# EAGLE board motherboard (EAGLE 9.4.2), part 1 of 2
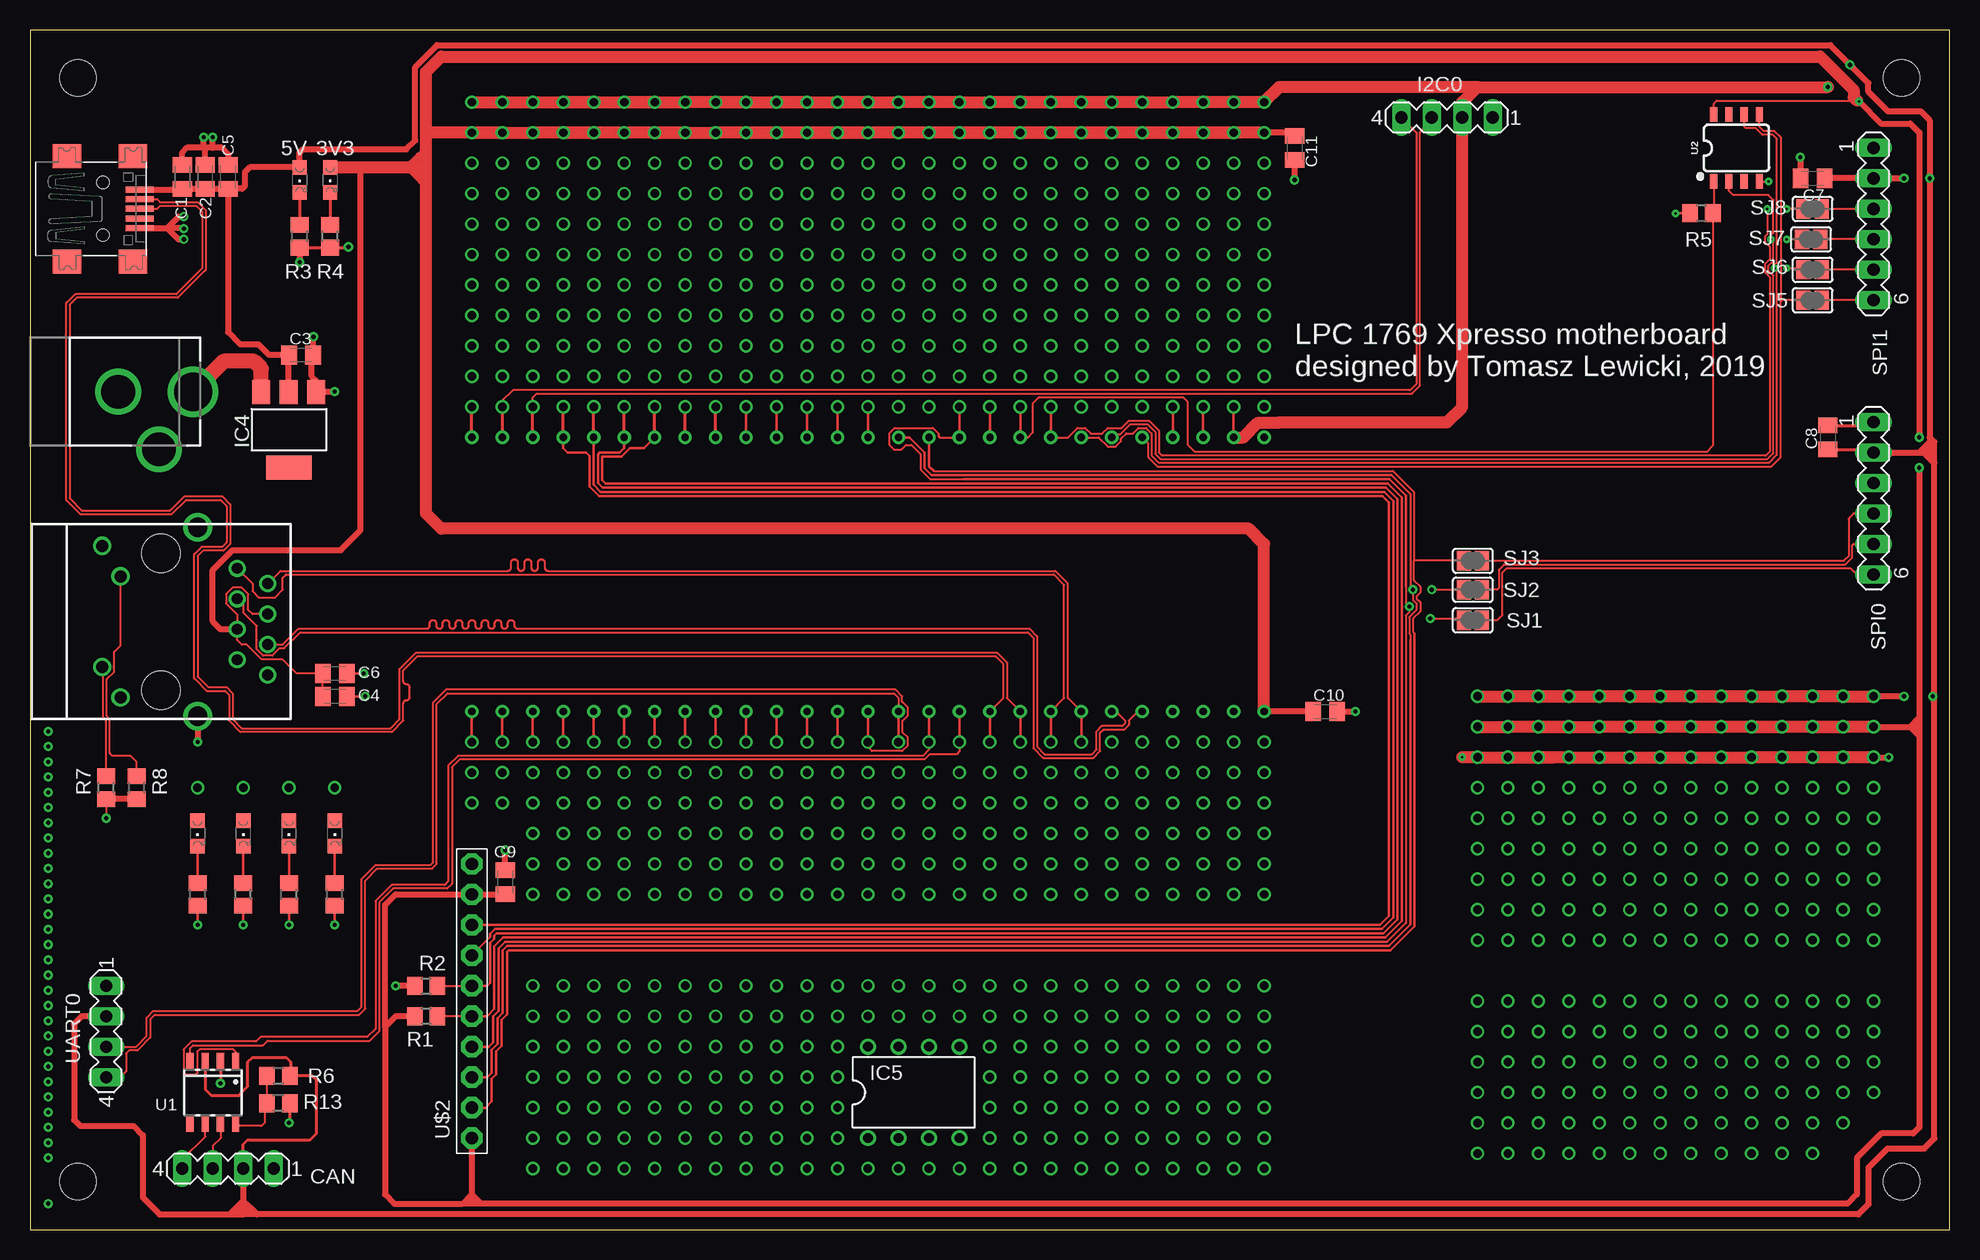
[diagram p1: board, top side]
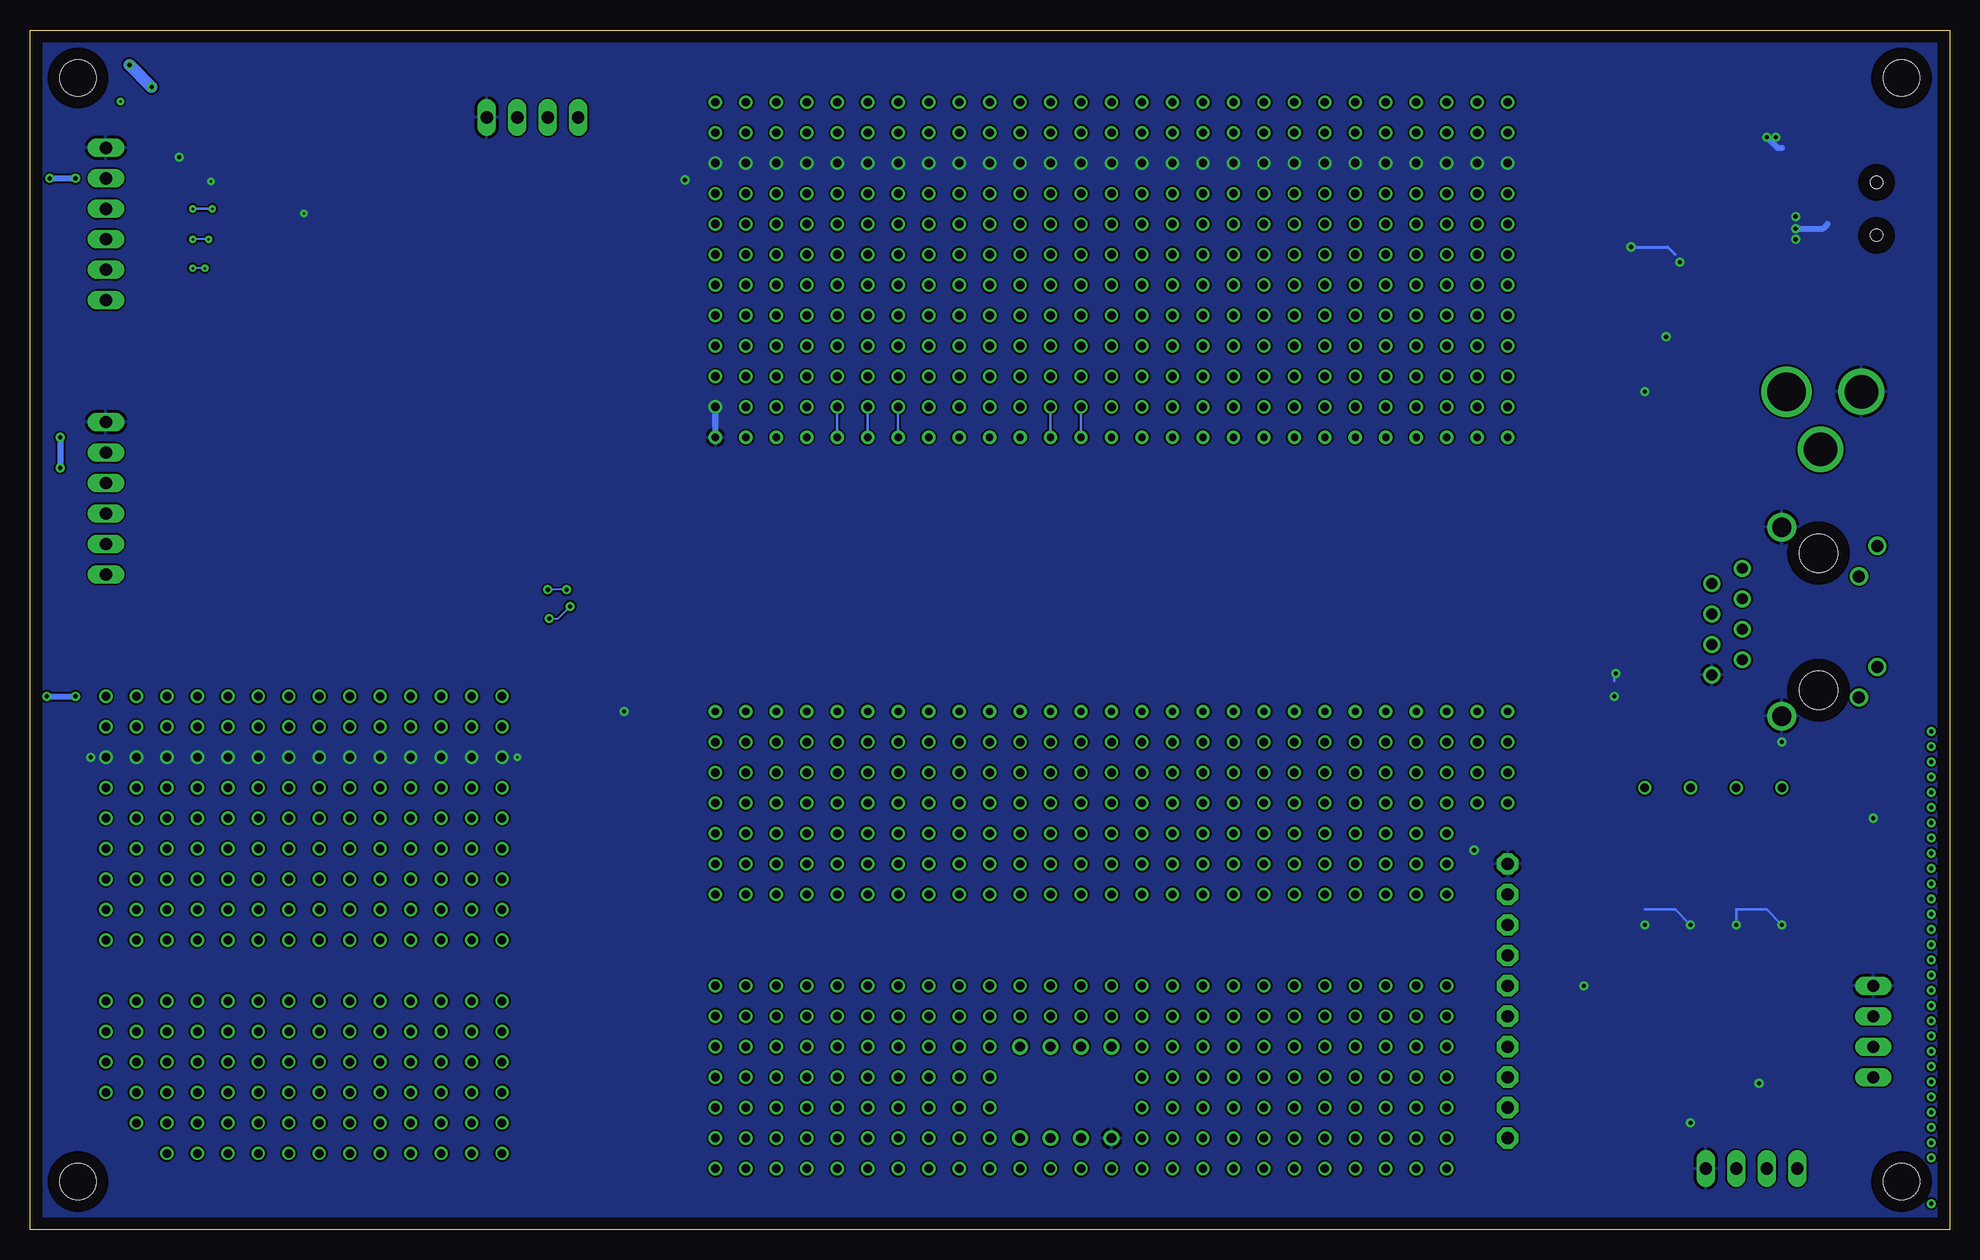
[diagram p2: board, bottom side, seen from below]

Size 160 x 100 mm. Coordinates in mm from the lower left corner, seen from the top.
Outline: 0,0 160,0 160,100 0,100 0,0
Copper layers (1*16): Top 0.035mm / dielectric 1.5mm / Bottom 0.035mm
Design rules "default *": minimum track width 6mil, minimum drill 0.2mm, track to track 6mil, track to pad 6mil, pad to pad 6mil, via to via 6mil, smd to smd 6mil, copper to edge 40mil, drill to drill 6mil, minimum pad ring 10mil, minimum via ring 8mil, stop-mask expansion 4mil, vias tented up to drill 0mil, thermal gap 10mil
Net classes: 1 power: width 0.406 mm
Holes 3 mm at 4,4 156,4 156,96 4,96

## Footprints (pad centres in the part's own frame; a part is rotated, then mirrored left to right if it is on the bottom)
CHIPLED_0805 = smd 1.2 x 1.2: A 0,-1.05; C 0,1.05
C0805K = smd 1.3 x 1.6: 1 -1,0; 2 1,0
MA04-1 = drill 1.016 long: 1 -3.81,0; 2 -1.27,0; 3 1.27,0; 4 3.81,0
USB-MINIB = smd 0.5 x 2.308: D+ 0,4.064; D- -0.8,4.064; GND 1.6,4.064; ID 0.8,4.064; VBUS -1.6,4.064 | smd 2 x 2.4: GND1 -4.4,-2; GND2 -4.4,3.5; GND3 4.4,3.5; GND4 4.4,-2 | hole 1: -2.2,1; 2.2,1
DCJACK_2MM_PTH = drill 2.8: GND 0,7.35; GNDBREAK 4.8,10.75 | drill 3.2: PWR 0,13.6
SOT223 = smd 1.499 x 2.007: 1 -2.261,-3.15; 2 0.025,-3.15; 3 2.311,-3.15 | smd 3.81 x 2.007: 4 0,3.15
DIL08 = drill 0.813 pad 1.27: 1 -3.81,-3.81; 2 -1.27,-3.81; 3 1.27,-3.81; 4 3.81,-3.81; 5 3.81,3.81; 6 1.27,3.81; 7 -1.27,3.81; 8 -3.81,3.81
J_ETHERNET_PULSE_J0011D01BNL = drill 0.9: 1 4.445,-6.35; 2 3.175,-8.89; 3 1.905,-6.35; 4 0.635,-8.89; 5 -0.635,-6.35; 6 -1.905,-8.89; 7 -3.175,-6.35; 8 -4.445,-8.89 | drill 1: 9 6.325,4.902; 10 3.785,3.378; 11 -3.785,4.902; 12 -6.325,3.378 | drill 1.6: SH1 -7.874,-3.048; SH2 7.874,-3.048 | hole 3.2: -5.715,0; 5.715,0
R0805 = smd 1.3 x 1.5: 1 -0.95,0; 2 0.95,0
SJ = smd 1.168 x 1.6: 1 -0.762,0; 2 0.762,0
MA06-1 = drill 1.016 long: 1 -6.35,0; 2 -3.81,0; 3 -1.27,0; 4 1.27,0; 5 3.81,0; 6 6.35,0
SOT96-1 = smd 0.6 x 1.3: 1 -1.905,-2.65; 2 -0.635,-2.65; 3 0.635,-2.65; 4 1.905,-2.65; 5 1.905,2.65; 6 0.635,2.65; 7 -0.635,2.65; 8 -1.905,2.65
SO08 = smd 0.6 x 1.2: 1 -1.905,-2.8; 2 -0.635,-2.8; 3 0.635,-2.8; 4 1.905,-2.8; 5 1.905,2.8; 6 0.635,2.8; 7 -0.635,2.8; 8 -1.905,2.8
LPC1769XPRESSO = drill 0.6: P$1 -33.02,-11.43; P$2 -30.48,-11.43; P$3 -27.94,-11.43; P$4 -25.4,-11.43; P$5 -22.86,-11.43; P$6 -20.32,-11.43; P$7 -17.78,-11.43; P$8 -15.24,-11.43; P$9 -12.7,-11.43; P$10 -10.16,-11.43; P$11 -7.62,-11.43; P$12 -5.08,-11.43; P$13 -2.54,-11.43; P$14 0,-11.43; P$15 2.54,-11.43; P$16 5.08,-11.43; P$17 7.62,-11.43; P$18 10.16,-11.43; P$19 12.7,-11.43; P$20 15.24,-11.43; P$21 17.78,-11.43; P$22 20.32,-11.43; P$23 22.86,-11.43; P$24 25.4,-11.43; P$25 27.94,-11.43; P$26 30.48,-11.43; P$27 33.02,-11.43; P$28 -33.02,11.43; P$29 -30.48,11.43; P$30 -27.94,11.43; P$31 -25.4,11.43; P$32 -22.86,11.43; P$33 -20.32,11.43; P$34 -17.78,11.43; P$35 -15.24,11.43; P$36 -12.7,11.43; P$37 -10.16,11.43; P$38 -7.62,11.43; P$39 -5.08,11.43; P$40 -2.54,11.43; P$41 0,11.43; P$42 2.54,11.43; P$43 5.08,11.43; P$44 7.62,11.43; P$45 10.16,11.43; P$46 12.7,11.43; P$47 15.24,11.43; P$48 17.78,11.43; P$49 20.32,11.43; P$50 22.86,11.43; P$51 25.4,11.43; P$52 27.94,11.43; P$53 30.48,11.43; P$54 33.02,11.43
1X10-BIG = drill 1.016 pad 1.778 octagon: 1 -11.43,0; 2 -8.89,0; 3 -6.35,0; 4 -3.81,0; 5 -1.27,0; 6 1.27,0; 7 3.81,0; 8 6.35,0; 9 8.89,0; 10 11.43,0

## Placement (x,y rotation side)
3V1  [CHIPLED_0805]  13.97,33.02 180 top
3V2  [CHIPLED_0805]  17.78,33.02 180 top
3V3  [CHIPLED_0805]  25.02,87.5 180 top
3V4  [CHIPLED_0805]  21.59,33.02 180 top
3V5  [CHIPLED_0805]  25.4,33.02 180 top
5V  [CHIPLED_0805]  22.48,87.5 180 top
C1  [C0805K]  12.7,87.76 90 top
C2  [C0805K]  14.61,87.76 90 top
C3  [C0805K]  22.61,72.9 0 top
C4  100n  [C0805K]  25.4,44.45 0 top
C5  [C0805K]  16.51,87.76 90 top
C6  100n  [C0805K]  25.4,46.35 0 top
C7  [C0805K]  148.59,87.63 180 top
C8  [C0805K]  149.86,66.04 90 top
C9  [C0805K]  39.62,28.96 90 top
C10  [C0805K]  107.95,43.18 0 top
C11  [C0805K]  105.41,90.17 270 top
CAN  [MA04-1]  16.51,5.08 180 top
CN1  [USB-MINIB]  5.08,85.09 270 top
CN2  [DCJACK_2MM_PTH]  0,69.85 270 top
I2C0  [MA04-1]  118.11,92.71 180 top
IC4  REG1117  [SOT223]  21.59,66.67 180 top
IC5  NE555N  [DIL08]  73.66,11.43 0 top
J1  J_ETHERNET_PULSE_J0011D01BNL  [J_ETHERNET_PULSE_J0011D01BNL]  10.92,50.67 90 top
R1  1k  [R0805]  33.02,17.78 180 top
R2  1k  [R0805]  33.02,20.32 0 top
R3  [R0805]  22.48,82.8 90 top
R4  [R0805]  25.02,82.8 90 top
R5  1k  [R0805]  139.32,84.71 180 top
R6  1k  [R0805]  20.7,12.83 0 top
R7  1k  [R0805]  6.35,36.83 90 top
R8  1k  [R0805]  8.89,36.83 90 top
R9  [R0805]  13.97,27.94 90 top
R10  [R0805]  17.78,27.94 90 top
R11  [R0805]  21.59,27.94 90 top
R12  [R0805]  25.4,27.94 90 top
R13  1k  [R0805]  20.7,10.54 180 top
SJ1  [SJ]  120.27,50.8 0 top
SJ2  [SJ]  120.27,53.34 0 top
SJ3  [SJ]  120.27,55.75 0 top
SJ5  [SJ]  148.59,77.47 0 top
SJ6  [SJ]  148.59,80.01 0 top
SJ7  [SJ]  148.46,82.55 0 top
SJ8  [SJ]  148.59,85.09 0 top
SPI0  [MA06-1]  153.67,60.96 270 top
SPI1  [MA06-1]  153.67,83.82 270 top
U1  TJA1050  [SOT96-1]  15.24,11.43 180 top
U2  4MB Flash  [SO08]  142.24,90.17 0 top
U$1  LPC1769XPRESSO  [LPC1769XPRESSO]  69.85,54.61 180 top
U$2  PINHD-1X10  [1X10-BIG]  36.83,19.05 90 top
UART0  [MA04-1]  6.35,16.51 270 top

## Tracks (layer width: path | path; a pad name or v marks a point on that pad's centre or on a via)
3V3  (via drill 0.2, 0.35, 0.7)
  Top 0.152: J1.4 18.54,51.31 18.2,51.65 18.2,52.96 17.66,53.51 16.89,53.51 16.34,52.96 16.34,52.19 17.27,51.26 J1.5 17.27,49.15 17.65,48.77 18.06,48.77 19.3,47.53 21.05,47.53 22.23,46.35 C6.1 C4.1 | U2.8 140.34,93.85 140.59,94.11 152.27,94.11 152.4,94.11 v152.46,94.04
  Top 0.508: v152.46,94.04 154.31,92.2 156.72,92.2 157.48,91.44 v157.48,66.04 | v157.48,63.5 157.48,42.67 | 157.48,42.67 157.48,42.55 | 157.48,42.55 157.48,41.91 | 157.48,41.91 157.48,41.15 | 157.48,41.15 157.48,8.51 156.97,8 154.31,8 152.27,5.97 152.27,2.92 151.51,2.16 37.59,2.16 | 37.59,2.16 36.83,2.16 | 36.83,2.16 36.07,2.16 | 36.07,2.16 30.35,2.16 29.59,2.92 29.59,16.89 | R1.2 30.48,17.78 29.59,16.89 | U$2.1 36.83,2.92 | 36.83,2.92 36.83,2.16 | 36.07,2.16 36.83,2.92 | 36.83,2.92 37.59,2.16 | 29.59,16.89 29.59,27.05 30.48,27.94 U$2.9 39.61,27.94 C9.1 | J1.5 15.88,50.04 15.24,50.67 15.24,54.99 16.89,56.64 25.91,56.64 27.56,58.29 27.56,88.17 27.94,88.55 | 32.38,89.53 31.75,88.9 31.75,88.55 32.1,88.9 33.02,88.9 32.38,89.53 | 32.38,89.53 33.02,90.17 | v153.67,41.91 156.72,41.91 | 156.72,41.91 156.84,41.91 | 157.48,41.91 156.84,41.91 | 157.48,42.55 156.84,41.91 | 156.84,41.91 156.84,41.78 157.48,41.15 | 157.48,42.67 156.72,41.91 | C11.1 105.14,91.44 v102.87,91.44 | C10.1 U$1.P$28
  Top 1.016: U$1.P$28 102.87,57.15 101.6,58.42 34.29,58.42 33.02,59.69 33.02,87.5 | 33.02,87.5 33.02,88.9 | 33.02,88.9 33.02,90.17 33.02,91.44 | 33.02,91.44 33.02,96.52 34.29,97.79 149.22,97.79 152.02,95 152.02,94.36 152.27,94.11 | 3V3.A 27.94,88.55 31.75,88.55 | 31.75,88.55 32.67,88.55 33.02,88.9 | 31.75,88.55 32.8,87.5 33.02,87.5 | v102.87,91.44 v100.33,91.44 | v100.33,91.44 v95.25,91.44 | v95.25,91.44 v90.17,91.44 | v90.17,91.44 v85.09,91.44 | v85.09,91.44 v80.01,91.44 | v80.01,91.44 v74.93,91.44 | v74.93,91.44 v69.85,91.44 v67.31,91.44 | v62.23,91.44 v57.15,91.44 v54.61,91.44 | v54.61,91.44 v46.99,91.44 | v46.99,91.44 v41.91,91.44 v39.37,91.44 | v39.37,91.44 33.02,91.44 | v36.83,91.44 v39.37,91.44 | v44.45,91.44 v46.99,91.44 | v49.53,91.44 v46.99,91.44 | v52.07,91.44 v54.61,91.44 | v59.69,91.44 v62.23,91.44 | v74.93,91.44 v77.47,91.44 v80.01,91.44 | v72.39,91.44 v67.31,91.44 | v67.31,91.44 v62.23,91.44 | v64.77,91.44 v67.31,91.44 | v82.55,91.44 v85.09,91.44 | v87.63,91.44 v90.17,91.44 | v92.71,91.44 v95.25,91.44 | v97.79,91.44 v100.33,91.44 | v151.13,41.91 v146.05,41.91 | v146.05,41.91 v140.97,41.91 | v140.97,41.91 v135.89,41.91 | v135.89,41.91 v130.81,41.91 v128.27,41.91 | v133.35,41.91 v135.89,41.91 | v138.43,41.91 v140.97,41.91 | v143.51,41.91 v146.05,41.91 | v148.59,41.91 v151.13,41.91 | v153.67,41.91 v151.13,41.91 | v128.27,41.91 v123.19,41.91 v120.65,41.91 | v125.73,41.91 v128.27,41.91
  Bottom 0.508: v157.48,66.04 v157.48,63.5
5V0  (via drill 0.35, 0.7)
  Top 0.2: v100.33,68.58 U$1.P$2
  Top 0.254: 12.06,86.69 12.63,86.69 C1.1 | U1.3 14.61,11.68 15.11,11.18 17.4,11.18 18.16,11.94 18.16,13.97 18.54,14.35 21.34,14.35 21.72,13.97 21.72,12.89 R6.2 23.5,12.83 23.88,12.45 23.88,8 23.37,7.49 18.16,7.49 17.78,7.11 CAN.2 | C8.1 153.4,65.04 SPI0.2
  Top 0.508: C5.1 17.67,86.76 17.91,87 17.91,88.14 18.32,88.55 5V.A 22.48,89.79 22.73,90.04 31.37,90.04 32.11,90.78 32.11,96.9 33.94,98.73 150.06,98.73 v151.7,97.09 153.23,95.56 153.23,94.85 154.87,93.22 157.61,93.22 158.35,92.48 v158.35,87.63 158.35,66.04 | CN1.VBUS 12.06,86.69 | C1.1 C2.1 C5.1 | IC4.2 21.57,72.86 C3.1 19.94,72.9 19.05,73.79 17.53,73.79 16.51,74.8 C5.1 | 158.73,44.45 158.73,7.6 157.9,6.77 154.85,6.77 153.23,5.15 153.23,2.1 152.4,1.27 18.92,1.27 | 158.73,44.45 158.73,63.9 | SPI0.2 157.48,64.77 | 157.48,64.77 157.86,64.77 | v156.21,87.63 SPI1.2 C7.1 | 158.73,63.9 158.31,64.33 | 158.31,64.33 157.86,64.77 | 158.31,64.33 158.35,64.37 158.35,64.77 | 158.35,66.04 158.35,65.53 | 158.35,65.53 158.35,64.77 | 157.48,64.77 158.24,65.53 158.35,65.53 | 158.35,64.77 157.86,64.77 | 158.73,63.9 158.73,65.66 158.35,66.04 | 158.73,44.45 v158.61,44.45 | v156.21,44.45 v153.67,44.45 | 18.92,1.27 18.35,1.84 | 18.35,1.84 17.78,2.41 | UART0.2 4.32,17.78 3.68,17.14 3.68,9.14 4.19,8.64 8.64,8.64 9.4,7.87 9.4,2.67 10.79,1.27 16.64,1.27 | 16.64,1.27 17.78,1.27 | 18.92,1.27 17.78,1.27 | 17.46,2.1 17.21,1.84 | 17.21,1.84 16.64,1.27 | 17.78,1.27 17.78,1.78 17.46,2.1 | 17.78,1.27 17.21,1.84 | 17.78,1.27 18.35,1.84 | CAN.2 17.78,2.41 | 17.78,2.41 17.46,2.1
  Top 1.016: U$1.P$2 101.15,66.04 102.37,67.25 104.08,67.25 104.14,67.31 118.11,67.31 119.38,68.58 I2C0.2 119.38,93.98 120.65,95.25 | 120.65,95.25 v149.86,95.25 | 120.65,95.25 104.14,95.25 v102.87,93.98 v100.33,93.98 v97.79,93.98 v95.25,93.98 v92.71,93.98 v90.17,93.98 | v36.83,93.98 v41.91,93.98 | v39.37,93.98 v41.91,93.98 | v90.17,93.98 v85.09,93.98 | v85.09,93.98 v80.01,93.98 v77.47,93.98 v74.93,93.98 v72.39,93.98 v67.31,93.98 | v82.55,93.98 v85.09,93.98 | v87.63,93.98 v90.17,93.98 | v41.91,93.98 v44.45,93.98 | v44.45,93.98 v49.53,93.98 | v49.53,93.98 v54.61,93.98 v57.15,93.98 | v57.15,93.98 v62.23,93.98 | v62.23,93.98 v67.31,93.98 | v69.85,93.98 v67.31,93.98 | v64.77,93.98 v62.23,93.98 | v59.69,93.98 v57.15,93.98 | v52.07,93.98 v49.53,93.98 | v46.99,93.98 v44.45,93.98 | v128.27,44.45 v123.19,44.45 v120.65,44.45 | v125.73,44.45 v128.27,44.45 | v140.97,44.45 v143.51,44.45 v146.05,44.45 v148.59,44.45 v151.13,44.45 v153.67,44.45 | v140.97,44.45 v135.89,44.45 | v135.89,44.45 v130.81,44.45 v128.27,44.45 | v133.35,44.45 v135.89,44.45 | v138.43,44.45 v140.97,44.45
  Bottom 0.508: v158.35,87.63 v156.21,87.63 | v158.61,44.45 v156.21,44.45
  Bottom 1.016: v149.86,95.25 v151.7,97.09
12V0
  Top 1.27: CN2.PWR 16.14,72.39 18.67,72.39 19.3,71.75 19.28,71.73 IC4.3
CAN_H
  Top 0.152: U1.7 15.88,7.62 15.24,6.99 CAN.3
CAN_L
  Top 0.152: CAN.4 12.7,5.84 14.61,7.75 U1.6
CAN_RX  (via drill 0.7)
  Top 0.152: v77.47,40.64 77.47,39.88 77.22,39.62 74.98,39.62 74.55,39.19 35.81,39.19 35.18,38.56 35.18,28.83 34.77,28.42 30.28,28.42 29.11,27.25 29.11,16.54 28.32,15.75 19.81,15.75 19.43,15.37 13.59,15.37 13.34,15.11 U1.4
  Top 0.2: U$1.P$38 v77.47,40.64
CAN_TX  (via drill 0.7)
  Top 0.152: v74.93,40.64 74.93,40.01 74.42,39.5 35.69,39.5 34.87,38.68 34.87,29.06 34.54,28.73 30.15,28.73 28.8,27.38 28.8,16.74 28.12,16.05 19.23,16.05 18.85,15.67 13.46,15.67 12.81,15.02 12.81,13.1 12.95,12.95 13.84,12.95 13.97,13.08 13.97,14.86 14.17,15.06 16.89,15.06 17.14,14.81 U1.1
  Top 0.2: U$1.P$39 v74.93,40.64
CARD_CS  (via drill 0.7)
  Top 0.152: R2.2 U$2.6
  Top 0.2: U$1.P$22 49.53,65.15 49.15,64.77 47.5,64.77 47.34,64.61 47.34,62.23 47.72,61.85 113.03,61.85 113.99,60.89 113.99,25.87 112.81,24.7 38.91,24.7 38.71,24.49 38.71,24.24 38.35,23.89 38.35,20.57 38.1,20.32 U$2.6
  Top 0.254: U$1.P$22 v49.53,68.58
CS1  (via drill 0.2, 0.7)
  Top 0.152: U$1.P$8 86.52,66.04 87.31,66.82 87.95,66.82 88.43,66.34 89.37,66.34 89.85,66.82 90.98,66.82 91.59,67.43 93.29,67.43 94.1,66.62 94.1,64.78 94.36,64.52 144.68,64.52 145.01,64.84 145.01,79.4 144.6,79.8 144.6,80.47 145.01,80.88 145.01,81.94 144.6,82.34 144.6,82.76 144.81,82.96 v144.81,85.09
  Top 0.2: SJ8.1 v146.43,85.09 | U$1.P$8 v85.09,68.58
  Bottom 0.2: v146.43,85.09 v144.81,85.09
ETH_RX_N
  Top 0.152: U$1.P$33 90.53,43.18 91.29,42.42 91.29,42.19 91.06,41.96 89.33,41.96 88.9,41.53 88.9,40.01 88.52,39.62 84.58,39.62 83.95,40.26 83.95,49.45 83.31,50.09 40.64,50.09 arc-90 40.37,50.35 40.37,50.54 arc90 40.11,50.8 40.1,50.8 arc90 39.83,50.54 39.83,50.35 arc-90 39.56,50.09 39.55,50.09 arc-90 39.29,50.35 39.29,50.54 arc90 39.02,50.8 39.01,50.8 arc90 38.74,50.54 38.74,50.35 arc-90 38.48,50.09 38.47,50.09 arc-90 38.2,50.35 38.2,50.54 arc90 37.94,50.8 37.93,50.8 arc90 37.66,50.54 37.66,50.35 arc-90 37.39,50.09 37.38,50.09 arc-90 37.12,50.35 37.12,50.54 arc90 36.85,50.8 36.84,50.8 arc90 36.57,50.54 36.57,50.35 arc-90 36.31,50.09 36.3,50.09 arc-90 36.03,50.35 36.03,50.54 arc90 35.76,50.8 35.75,50.8 arc90 35.49,50.54 35.49,50.35 arc-90 35.22,50.09 35.21,50.09 arc-90 34.95,50.35 34.95,50.54 arc90 34.68,50.8 34.67,50.8 arc90 34.4,50.54 34.4,50.35 arc-90 34.13,50.09 34.13,50.09 arc-90 33.86,50.35 33.86,50.54 arc90 33.59,50.8 33.58,50.8 arc90 33.32,50.54 33.32,50.35 arc-90 33.05,50.09 22.4,50.09 21.08,48.77 J1.6
ETH_RX_P
  Top 0.152: U$1.P$32 92.35,43.18 91.59,42.42 91.59,42.06 91.19,41.66 89.46,41.66 89.2,41.4 89.2,39.88 88.64,39.32 84.46,39.32 83.64,40.13 83.64,49.33 83.19,49.78 22.53,49.78 21.21,48.46 20.83,48.46 20.2,47.84 19.43,47.84 18.88,48.38 18.88,49.15 18.9,49.17 18.9,50.32 17.78,51.44 17.78,52.07 J1.3
ETH_TX_N  (via drill 0.7)
  Top 0.152: U$1.P$34 86.51,44.3 86.51,53.87 85.47,54.91 43.18,54.91 arc-90 42.91,55.18 42.91,55.6 arc90 42.65,55.87 42.62,55.87 arc90 42.35,55.6 42.35,55.18 arc-90 42.08,54.91 42.05,54.91 arc-90 41.79,55.18 41.79,55.6 arc90 41.52,55.87 41.49,55.87 arc90 41.23,55.6 41.23,55.18 arc-90 40.96,54.91 40.93,54.91 arc-90 40.66,55.18 40.66,55.6 arc90 40.4,55.87 40.37,55.87 arc90 40.1,55.6 40.1,55.18 arc-90 39.84,54.91 20.88,54.91 J1.2
  Top 0.2: v87.63,40.64 U$1.P$34
ETH_TX_P  (via drill 0.7)
  Top 0.152: U$1.P$35 86.21,44.3 86.21,53.75 85.34,54.61 21.34,54.61 21.08,54.36 21.08,53.34 20.45,52.7 19.05,52.7 18.54,53.21 18.54,53.85 J1.1
  Top 0.2: U$1.P$35 v85.09,40.64
GND  (via drill 0.2, 0.35, 0.7)
  Top 0.152: R7.1 v6.35,34.29 | U2.4 v144.9,87.37 v144.91,87.38
  Top 0.2: R9.1 v13.97,25.4 | R10.1 v17.78,25.4 | R11.1 v21.59,25.4 | R12.1 v25.4,25.4 | C6.2 v27.81,46.35 | C4.2 v27.94,44.45 | R5.2 v137.16,84.71
  Top 0.254: v26.54,81.92 26.48,81.85 R4.1 R3.1 | U1.2 v15.88,12.19 | R13.1 21.65,8.95 v21.59,8.89 | C8.2 153.4,67.04 SPI0.1
  Top 0.508: 11.43,83.49 12.78,83.49 v12.83,83.44 | CN1.GND 11.43,83.49 | 11.43,83.49 12.37,82.55 v12.83,82.55 | 11.43,83.49 12.39,84.45 v12.83,84.45 | C1.2 12.7,89.79 13.08,90.17 14.48,90.17 | 15.24,90.17 16,90.17 16.51,89.66 C5.2 | 15.24,90.17 14.48,90.17 | C2.2 14.61,90.04 14.48,90.17 | 14.48,90.17 v14.48,91.06 | 15.24,90.17 v15.24,91.06 | J1.SH1 v13.97,40.64 | R8.1 R7.1 | R3.1 v22.48,80.64 | v23.62,74.42 23.61,74.41 C3.2 23.5,72.79 23.5,71.12 23.85,70.76 IC4.1 23.88,69.85 v25.4,69.85 | R2.1 v30.48,20.32 | v153.67,39.37 v154.94,39.37 | C7.2 147.59,89.39 v147.57,89.41 | C9.2 v39.62,31.62 | C11.2 v105.41,87.5 | C10.2 v110.49,43.18
  Top 1.016: v153.67,39.37 v151.13,39.37 v148.59,39.37 v143.51,39.37 v140.97,39.37 v138.43,39.37 v135.89,39.37 v133.35,39.37 v130.81,39.37 v128.27,39.37 v125.73,39.37 | v119.38,39.37 v120.65,39.37 v123.19,39.37 v125.73,39.37 | v125.73,39.37 127.08,39.37
  Bottom 0.2: v13.97,25.4 15.24,26.67 17.78,26.67 v17.78,25.4 | v21.59,25.4 22.86,26.67 25.4,26.67 | v27.81,46.35 27.94,46.23 27.94,45.72
  Bottom 0.254: v26.54,81.92 23.5,81.92 22.86,81.28
  Bottom 0.508: v12.83,83.44 10.54,83.44 10.16,83.82 | v15.24,91.06 14.35,90.17 13.97,90.17 | U$1.P$1 v102.87,68.58
  other vias: 36.83,88.9 39.37,88.9 41.91,88.9 44.45,88.9 46.99,88.9 49.53,88.9 52.07,88.9 54.61,88.9 57.15,88.9 59.69,88.9 62.23,88.9 64.77,88.9 67.31,88.9 69.85,88.9 72.39,88.9 74.93,88.9 77.47,88.9 80.01,88.9 85.09,88.9 82.55,88.9 87.63,88.9 90.17,88.9 92.71,88.9 95.25,88.9 97.79,88.9 100.33,88.9 102.87,88.9 146.05,39.37
  pour Bottom: 0,100.33 160.02,100.33 160.02,0 0,0
I2C_SDA  (via drill 0.7)
  Top 0.152: I2C0.3 116.84,92.46 115.88,91.49 115.88,70.36 115.19,69.67 42.24,69.67 41.91,69.34 v41.91,68.58
  Top 0.254: U$1.P$25 v41.91,68.58
LCD_CS  (via drill 0.7)
  Top 0.152: U$2.5 R1.1
  Top 0.2: U$2.5 38.1,17.78 38.71,18.39 38.71,23.59 39.46,24.34 112.96,24.34 114.34,25.72 114.34,61.04 113.18,62.2 47.98,62.2 47.7,62.48 47.7,64.42 49.3,64.42 50.03,65.15 51.18,65.15 U$1.P$21
  Top 0.254: U$1.P$21 v52.07,68.58
LCD_O/C  (via drill 0.7)
  Top 0.2: U$1.P$23 46.99,62.08 47.58,61.5 112.88,61.5 113.64,60.74 113.64,26.02 112.67,25.05 111.76,25.05 38.76,25.05 38.35,24.64 38.35,24.38 U$2.7
  Top 0.254: U$1.P$23 v46.99,68.58
LCD_RST  (via drill 0.7)
  Top 0.152: 44.58,65.91 U$1.P$24
  Top 0.2: U$1.P$24 44.45,65.15 44.83,64.77 46.35,64.77 46.64,64.49 46.64,61.94 47.43,61.14 112.74,61.14 112.98,60.91 113.25,60.64 113.28,60.6 113.28,45.72 113.28,26.16 112.52,25.4 U$2.8
  Top 0.254: U$1.P$24 v44.45,68.58
MISO0  (via drill 0.7)
  Top 0.152: 115.37,55.75 115.37,61.18 115.38,61.19 115.38,61.46 113.6,63.23 75.32,63.23 74.99,63.56 | SJ3.1 115.37,55.75 | 115.37,55.75 115.37,54.11 115.88,53.59 115.88,53.09 115.58,52.79 115.58,52.62 115.88,52.32 115.88,51.52 115.28,50.92 115.28,49.82 115.39,49.7 | 115.39,25.29 115.4,25.29
  Top 0.2: U$2.2 37.97,10.16 38.48,10.67 38.48,12.58 38.83,12.94 38.83,14.85 39.31,15.33 39.31,17.48 39.76,17.93 39.76,23.13 39.92,23.29 113.4,23.29 115.4,25.29 115.41,25.3 115.41,49.68 115.39,49.7 | 75.3,63.26 74.99,63.56 74.93,63.63 U$1.P$12
  Bottom 0.2: U$1.P$12 v74.93,68.58
MISO1  (via drill 0.2, 0.7)
  Top 0.152: U$1.P$6 90.42,66.29 90.88,66.29 91.72,67.13 93.16,67.13 93.8,66.49 93.8,64.65 94.23,64.21 144.81,64.21 145.31,64.72 145.31,79.52 144.91,79.93 144.91,80.35 145.31,80.75 145.31,82.35 v145.11,82.55 145.11,82.88 145.31,83.08 145.31,85.83 144.91,86.23 141.99,86.23 141.6,86.61 U2.2 | v146.43,82.55 SJ7.1
  Bottom 0.152: v145.11,82.55 v146.43,82.55
  Bottom 0.2: U$1.P$6 v90.17,68.58
MOSI0  (via drill 0.35, 0.7)
  Top 0.152: 77.98,62.55 75.04,62.55 74.25,63.34 74.25,64.63 73.48,65.41 73.03,65.41 72.64,65.02 72.01,65.02 71.61,65.43 71.61,66.36 72.07,66.82 75.25,66.82 75.71,66.36 75.71,66.15 75.82,66.04 U$1.P$11 | 114.69,53.65 114.69,53.62 114.67,53.59 114.67,52.24 v114.97,51.94 114.97,51.47 114.67,51.17 114.67,25.55 | v116.71,50.93 119.38,50.93 SJ1.1
  Top 0.2: U$2.4 38.23,15.24 38.61,15.62 38.61,17.79 39.06,18.24 39.06,23.43 39.62,23.99 113.11,23.99 114.67,25.55 | 77.85,62.55 77.98,62.55 113.32,62.55 114.69,61.18 114.69,53.65 | U$1.P$11 v77.47,68.58
  Bottom 0.152: v116.71,50.93 115.99,50.93 v114.97,51.94
MOSI1  (via drill 0.7)
  Top 0.152: U$1.P$5 93.19,65.56 93.19,64.4 93.98,63.6 145.14,63.6 145.92,64.39 145.92,77.34 | U2.5 144.15,91.95 144.53,91.57 145.41,91.57 145.92,91.06 145.92,77.6 | 145.92,77.34 145.92,77.47 | 145.92,77.6 145.92,77.47 | SJ5.1 146.05,77.47 | 145.92,77.47 146.05,77.47 | 146.05,77.47 145.92,77.34 | 146.05,77.47 145.92,77.6
  Bottom 0.2: v92.71,68.58 U$1.P$5
N$1
  Top 0.254: 5V.C R3.2
N$2  (via drill 0.7)
  other vias: 13.97,36.83
N$3
  Top 0.254: 3V3.C R4.2
N$4  (via drill 0.7)
  Top 0.152: I2C0.4 115.57,91.44 115.57,70.48 115.06,69.98 40.26,69.98 39.37,69.09 v39.37,68.58
  Top 0.254: v39.37,68.58 U$1.P$26
N$5  (via drill 0.7)
  other vias: 17.78,36.83
N$6  (via drill 0.7)
  other vias: 21.59,36.83
N$7  (via drill 0.7)
  other vias: 25.4,36.83
N$8  (via drill 0.7)
  Top 0.2: U$1.P$14 v69.85,68.58
N$9
  Top 0.152: SJ1.2 122.3,50.8 122.73,51.23 122.73,54.79 123.09,55.14 151.74,55.14 152.27,54.61 SPI0.6
N$10
  Top 0.152: SPI0.5 152.02,57.15 151.89,57.02 151.89,56.01 151.33,55.45 122.89,55.45 122.43,54.99 122.43,53.47 122.3,53.34 SJ2.2
N$11
  Top 0.152: SJ3.2 151.21,55.75 151.59,56.13 151.59,59.26 152.02,59.69 SPI0.4
N$12  (via drill 0.7)
  other vias: 57.15,15.24
N$13  (via drill 0.7)
  other vias: 59.69,15.24
N$14  (via drill 0.7)
  other vias: 62.23,15.24
N$15  (via drill 0.7)
  other vias: 67.31,12.7
N$16  (via drill 0.7)
  other vias: 57.15,12.7
N$17  (via drill 0.7)
  other vias: 59.69,12.7
N$18  (via drill 0.7)
  other vias: 62.23,12.7
N$19  (via drill 0.7)
  other vias: 64.77,12.7
N$20  (via drill 0.7)
  other vias: 57.15,10.16
N$21  (via drill 0.7)
  other vias: 59.69,10.16
N$22  (via drill 0.7)
  other vias: 62.23,10.16
N$23  (via drill 0.7)
  other vias: 64.77,10.16
N$24  (via drill 0.7)
  other vias: 57.15,7.62
N$25  (via drill 0.7)
  other vias: 59.69,7.62
N$26  (via drill 0.7)
  other vias: 62.23,7.62
N$27  (via drill 0.7)
  other vias: 64.77,7.62
N$28  (via drill 0.7)
  other vias: 67.31,10.16
N$29  (via drill 0.7)
  other vias: 67.31,7.62
N$30
  Top 0.152: U1.8 17.29,8.64 19.3,8.64 19.56,8.89 19.56,10.35 R13.2 R6.1
N$31  (via drill 0.35)
  other vias: 1.52,9.78
N$32  (via drill 0.35)
  other vias: 1.52,8.51
N$33  (via drill 0.35)
  other vias: 1.52,7.24
N$34  (via drill 0.35)
  other vias: 1.52,5.97
N$37  (via drill 0.35)
  other vias: 1.52,2.16
N$51  (via drill 0.7)
  other vias: 90.17,40.64
N$52  (via drill 0.7)
  other vias: 92.71,40.64
N$53  (via drill 0.7)
  other vias: 95.25,40.64
N$54  (via drill 0.7)
  other vias: 97.79,40.64
N$55  (via drill 0.7)
  other vias: 100.33,40.64
N$56  (via drill 0.7)
  other vias: 102.87,40.64
N$60
  Top 0.152: J1.11 6.1,46.81 6.1,42.67 6.35,42.42 R7.2
N$61
  Top 0.152: R8.2 8.89,38.99 8.38,39.5 6.86,39.5 6.66,39.7 6.66,42.54 6.4,42.8 6.4,45.88 7,46.48 7,48.15 7.54,48.69 J1.10
N$63  (via drill 0.7)
  other vias: 128.27,24.13
N$67
  Top 0.2: 3V1.C R9.2
N$68
  Top 0.2: 3V2.C R10.2
N$69
  Top 0.2: 3V4.C R11.2
N$70
  Top 0.2: R12.2 3V5.C
N$71  (via drill 0.7)
  other vias: 36.83,71.12
N$72  (via drill 0.7)
  other vias: 39.37,71.12
N$73  (via drill 0.7)
  other vias: 41.91,71.12
N$74  (via drill 0.7)
  other vias: 44.45,71.12
N$75  (via drill 0.7)
  other vias: 46.99,71.12
N$76  (via drill 0.7)
  other vias: 49.53,71.12
N$77  (via drill 0.7)
  other vias: 52.07,71.12
N$78  (via drill 0.7)
  other vias: 54.61,71.12
N$79  (via drill 0.7)
  other vias: 57.15,71.12
N$80  (via drill 0.7)
  other vias: 59.69,71.12
N$81  (via drill 0.7)
  other vias: 62.23,71.12
N$82  (via drill 0.7)
  other vias: 64.77,71.12
N$83  (via drill 0.7)
  other vias: 67.31,71.12
N$84  (via drill 0.7)
  other vias: 69.85,71.12
N$85  (via drill 0.7)
  other vias: 72.39,71.12
N$86  (via drill 0.7)
  other vias: 74.93,71.12
N$87  (via drill 0.7)
  other vias: 77.47,71.12
N$88  (via drill 0.7)
  other vias: 80.01,71.12
N$89  (via drill 0.7)
  other vias: 82.55,71.12
N$90  (via drill 0.7)
  other vias: 85.09,71.12
N$91  (via drill 0.7)
  other vias: 87.63,71.12
N$92  (via drill 0.7)
  other vias: 90.17,71.12
N$93  (via drill 0.7)
  other vias: 92.71,71.12
N$94  (via drill 0.7)
  other vias: 95.25,71.12
N$95  (via drill 0.7)
  other vias: 97.79,71.12
N$96  (via drill 0.7)
  other vias: 100.33,71.12
N$97  (via drill 0.7)
  other vias: 102.87,71.12
N$98  (via drill 0.7)
  other vias: 36.83,73.66
N$99  (via drill 0.7)
  other vias: 39.37,73.66
N$100  (via drill 0.7)
  other vias: 41.91,73.66
N$101  (via drill 0.7)
  other vias: 44.45,73.66
N$102  (via drill 0.7)
  other vias: 46.99,73.66
N$103  (via drill 0.7)
  other vias: 49.53,73.66
N$104  (via drill 0.7)
  other vias: 52.07,73.66
N$105  (via drill 0.7)
  other vias: 54.61,73.66
N$106  (via drill 0.7)
  other vias: 57.15,73.66
N$107  (via drill 0.7)
  other vias: 59.69,73.66
N$108  (via drill 0.7)
  other vias: 62.23,73.66
N$109  (via drill 0.7)
  other vias: 64.77,73.66
N$110  (via drill 0.7)
  other vias: 67.31,73.66
N$111  (via drill 0.7)
  other vias: 69.85,73.66
N$112  (via drill 0.7)
  other vias: 72.39,73.66
N$113  (via drill 0.7)
  other vias: 74.93,73.66
N$114  (via drill 0.7)
  other vias: 77.47,73.66
N$115  (via drill 0.7)
  other vias: 80.01,73.66
N$116  (via drill 0.7)
  other vias: 82.55,73.66
N$117  (via drill 0.7)
  other vias: 85.09,73.66
N$118  (via drill 0.7)
  other vias: 87.63,73.66
N$119  (via drill 0.7)
  other vias: 90.17,73.66
N$120  (via drill 0.7)
  other vias: 92.71,73.66
N$121  (via drill 0.7)
  other vias: 95.25,73.66
N$122  (via drill 0.7)
  other vias: 97.79,73.66
N$123  (via drill 0.7)
  other vias: 100.33,73.66
N$124  (via drill 0.7)
  other vias: 102.87,73.66
N$125  (via drill 0.7)
  other vias: 36.83,76.2
N$126  (via drill 0.7)
  other vias: 39.37,76.2
N$127  (via drill 0.7)
  other vias: 41.91,76.2
N$128  (via drill 0.7)
  other vias: 44.45,76.2
N$129  (via drill 0.7)
  other vias: 46.99,76.2
N$130  (via drill 0.7)
  other vias: 49.53,76.2
N$131  (via drill 0.7)
  other vias: 52.07,76.2
N$132  (via drill 0.7)
  other vias: 54.61,76.2
N$133  (via drill 0.7)
  other vias: 57.15,76.2
N$134  (via drill 0.7)
  other vias: 59.69,76.2
N$135  (via drill 0.7)
  other vias: 62.23,76.2
N$136  (via drill 0.7)
  other vias: 64.77,76.2
N$137  (via drill 0.7)
  other vias: 67.31,76.2
N$138  (via drill 0.7)
  other vias: 69.85,76.2
N$139  (via drill 0.7)
  other vias: 72.39,76.2
N$140  (via drill 0.7)
  other vias: 74.93,76.2
N$141  (via drill 0.7)
  other vias: 77.47,76.2
N$142  (via drill 0.7)
  other vias: 80.01,76.2
N$143  (via drill 0.7)
  other vias: 82.55,76.2
N$144  (via drill 0.7)
  other vias: 85.09,76.2
N$145  (via drill 0.7)
  other vias: 87.63,76.2
N$146  (via drill 0.7)
  other vias: 90.17,76.2
N$147  (via drill 0.7)
  other vias: 92.71,76.2
N$148  (via drill 0.7)
  other vias: 95.25,76.2
N$149  (via drill 0.7)
  other vias: 97.79,76.2
N$150  (via drill 0.7)
  other vias: 100.33,76.2
N$151  (via drill 0.7)
  other vias: 102.87,76.2
N$152  (via drill 0.7)
  other vias: 36.83,78.74
N$153  (via drill 0.7)
  other vias: 39.37,78.74
N$154  (via drill 0.7)
  other vias: 41.91,78.74
N$155  (via drill 0.7)
  other vias: 44.45,78.74
N$156  (via drill 0.7)
  other vias: 46.99,78.74
N$157  (via drill 0.7)
  other vias: 49.53,78.74
N$158  (via drill 0.7)
  other vias: 52.07,78.74
N$159  (via drill 0.7)
  other vias: 54.61,78.74
N$160  (via drill 0.7)
  other vias: 57.15,78.74
N$161  (via drill 0.7)
  other vias: 59.69,78.74
N$162  (via drill 0.7)
  other vias: 62.23,78.74
N$163  (via drill 0.7)
  other vias: 64.77,78.74
N$164  (via drill 0.7)
  other vias: 67.31,78.74
N$165  (via drill 0.7)
  other vias: 69.85,78.74
N$166  (via drill 0.7)
  other vias: 72.39,78.74
N$167  (via drill 0.7)
  other vias: 74.93,78.74
N$168  (via drill 0.7)
  other vias: 77.47,78.74
N$169  (via drill 0.7)
  other vias: 80.01,78.74
N$170  (via drill 0.7)
  other vias: 82.55,78.74
N$171  (via drill 0.7)
  other vias: 85.09,78.74
N$172  (via drill 0.7)
  other vias: 87.63,78.74
N$173  (via drill 0.7)
  other vias: 90.17,78.74
N$174  (via drill 0.7)
  other vias: 92.71,78.74
N$175  (via drill 0.7)
  other vias: 95.25,78.74
N$176  (via drill 0.7)
  other vias: 97.79,78.74
N$177  (via drill 0.7)
  other vias: 100.33,78.74
N$178  (via drill 0.7)
  other vias: 102.87,78.74
N$179  (via drill 0.7)
  other vias: 36.83,81.28
N$180  (via drill 0.7)
  other vias: 39.37,81.28
N$181  (via drill 0.7)
  other vias: 41.91,81.28
N$182  (via drill 0.7)
  other vias: 44.45,81.28
N$183  (via drill 0.7)
  other vias: 46.99,81.28
N$184  (via drill 0.7)
  other vias: 49.53,81.28
N$185  (via drill 0.7)
  other vias: 52.07,81.28
N$186  (via drill 0.7)
  other vias: 54.61,81.28
N$187  (via drill 0.7)
  other vias: 57.15,81.28
N$188  (via drill 0.7)
  other vias: 59.69,81.28
N$189  (via drill 0.7)
  other vias: 62.23,81.28
N$190  (via drill 0.7)
  other vias: 64.77,81.28
N$191  (via drill 0.7)
  other vias: 67.31,81.28
N$192  (via drill 0.7)
  other vias: 69.85,81.28
N$193  (via drill 0.7)
  other vias: 72.39,81.28
N$194  (via drill 0.7)
  other vias: 74.93,81.28
N$195  (via drill 0.7)
  other vias: 77.47,81.28
N$196  (via drill 0.7)
  other vias: 80.01,81.28
N$197  (via drill 0.7)
  other vias: 82.55,81.28
N$198  (via drill 0.7)
  other vias: 85.09,81.28
N$199  (via drill 0.7)
  other vias: 87.63,81.28
N$200  (via drill 0.7)
  other vias: 90.17,81.28
N$201  (via drill 0.7)
  other vias: 92.71,81.28
N$202  (via drill 0.7)
  other vias: 95.25,81.28
N$203  (via drill 0.7)
  other vias: 97.79,81.28
N$204  (via drill 0.7)
  other vias: 100.33,81.28
N$205  (via drill 0.7)
  other vias: 102.87,81.28
N$206  (via drill 0.7)
  other vias: 36.83,83.82
N$207  (via drill 0.7)
  other vias: 39.37,83.82
N$208  (via drill 0.7)
  other vias: 41.91,83.82
N$209  (via drill 0.7)
  other vias: 44.45,83.82
N$210  (via drill 0.7)
  other vias: 46.99,83.82
N$211  (via drill 0.7)
  other vias: 49.53,83.82
N$212  (via drill 0.7)
  other vias: 52.07,83.82
N$213  (via drill 0.7)
  other vias: 54.61,83.82
N$214  (via drill 0.7)
  other vias: 57.15,83.82
N$215  (via drill 0.7)
  other vias: 59.69,83.82
N$216  (via drill 0.7)
  other vias: 62.23,83.82
N$217  (via drill 0.7)
  other vias: 64.77,83.82
N$218  (via drill 0.7)
  other vias: 67.31,83.82
N$219  (via drill 0.7)
  other vias: 69.85,83.82
N$220  (via drill 0.7)
  other vias: 72.39,83.82
N$221  (via drill 0.7)
  other vias: 74.93,83.82
N$222  (via drill 0.7)
  other vias: 77.47,83.82
N$223  (via drill 0.7)
  other vias: 80.01,83.82
N$224  (via drill 0.7)
  other vias: 82.55,83.82
N$225  (via drill 0.7)
  other vias: 85.09,83.82
N$226  (via drill 0.7)
  other vias: 87.63,83.82
N$227  (via drill 0.7)
  other vias: 90.17,83.82
N$228  (via drill 0.7)
  other vias: 92.71,83.82
N$229  (via drill 0.7)
  other vias: 95.25,83.82
N$230  (via drill 0.7)
  other vias: 97.79,83.82
N$231  (via drill 0.7)
  other vias: 100.33,83.82
N$232  (via drill 0.7)
  other vias: 102.87,83.82
N$233  (via drill 0.7)
  other vias: 36.83,86.36
N$234  (via drill 0.7)
  other vias: 39.37,86.36
N$235  (via drill 0.7)
  other vias: 41.91,86.36
N$236  (via drill 0.7)
  other vias: 44.45,86.36
N$237  (via drill 0.7)
  other vias: 46.99,86.36
N$238  (via drill 0.7)
  other vias: 49.53,86.36
N$239  (via drill 0.7)
  other vias: 52.07,86.36
N$240  (via drill 0.7)
  other vias: 54.61,86.36
N$241  (via drill 0.7)
  other vias: 57.15,86.36
N$242  (via drill 0.7)
  other vias: 59.69,86.36
N$243  (via drill 0.7)
  other vias: 62.23,86.36
N$244  (via drill 0.7)
  other vias: 64.77,86.36
N$245  (via drill 0.7)
  other vias: 67.31,86.36
N$246  (via drill 0.7)
  other vias: 69.85,86.36
N$247  (via drill 0.7)
  other vias: 72.39,86.36
N$248  (via drill 0.7)
  other vias: 74.93,86.36
N$249  (via drill 0.7)
  other vias: 77.47,86.36
N$250  (via drill 0.7)
  other vias: 80.01,86.36
N$251  (via drill 0.7)
  other vias: 82.55,86.36
N$252  (via drill 0.7)
  other vias: 85.09,86.36
N$253  (via drill 0.7)
  other vias: 87.63,86.36
N$254  (via drill 0.7)
  other vias: 90.17,86.36
N$255  (via drill 0.7)
  other vias: 92.71,86.36
N$256  (via drill 0.7)
  other vias: 95.25,86.36
N$257  (via drill 0.7)
  other vias: 97.79,86.36
N$258  (via drill 0.7)
  other vias: 100.33,86.36
N$259  (via drill 0.7)
  other vias: 102.87,86.36
N$260  (via drill 0.7)
  other vias: 130.81,24.13
N$261  (via drill 0.7)
  other vias: 133.35,24.13
N$262  (via drill 0.7)
  other vias: 135.89,24.13
N$263  (via drill 0.7)
  other vias: 138.43,24.13
N$264  (via drill 0.7)
  other vias: 140.97,24.13
N$265  (via drill 0.7)
  other vias: 143.51,24.13
N$266  (via drill 0.7)
  other vias: 146.05,24.13
N$267  (via drill 0.7)
  other vias: 148.59,24.13
N$268  (via drill 0.7)
  other vias: 151.13,24.13
N$269  (via drill 0.7)
  other vias: 153.67,24.13
N$270  (via drill 0.7)
  other vias: 128.27,26.67
N$271  (via drill 0.7)
  other vias: 130.81,26.67
N$272  (via drill 0.7)
  other vias: 133.35,26.67
N$273  (via drill 0.7)
  other vias: 135.89,26.67
N$274  (via drill 0.7)
  other vias: 138.43,26.67
N$275  (via drill 0.7)
  other vias: 140.97,26.67
N$276  (via drill 0.7)
  other vias: 143.51,26.67
N$277  (via drill 0.7)
  other vias: 146.05,26.67
N$278  (via drill 0.7)
  other vias: 148.59,26.67
N$279  (via drill 0.7)
  other vias: 151.13,26.67
N$280  (via drill 0.7)
  other vias: 153.67,26.67
N$281  (via drill 0.7)
  other vias: 128.27,29.21
N$282  (via drill 0.7)
  other vias: 130.81,29.21
N$283  (via drill 0.7)
  other vias: 133.35,29.21
N$284  (via drill 0.7)
  other vias: 135.89,29.21
N$285  (via drill 0.7)
  other vias: 138.43,29.21
N$286  (via drill 0.7)
  other vias: 140.97,29.21
N$287  (via drill 0.7)
  other vias: 143.51,29.21
N$288  (via drill 0.7)
  other vias: 146.05,29.21
N$289  (via drill 0.7)
  other vias: 148.59,29.21
N$290  (via drill 0.7)
  other vias: 151.13,29.21
N$291  (via drill 0.7)
  other vias: 153.67,29.21
N$292  (via drill 0.7)
  other vias: 128.27,31.75
N$293  (via drill 0.7)
  other vias: 130.81,31.75
N$294  (via drill 0.7)
  other vias: 133.35,31.75
N$295  (via drill 0.7)
  other vias: 135.89,31.75
N$296  (via drill 0.7)
  other vias: 138.43,31.75
N$297  (via drill 0.7)
  other vias: 140.97,31.75
N$298  (via drill 0.7)
  other vias: 143.51,31.75
N$299  (via drill 0.7)
  other vias: 146.05,31.75
N$300  (via drill 0.7)
  other vias: 148.59,31.75
N$301  (via drill 0.7)
  other vias: 151.13,31.75
N$302  (via drill 0.7)
  other vias: 153.67,31.75
N$303  (via drill 0.7)
  other vias: 128.27,34.29
N$304  (via drill 0.7)
  other vias: 130.81,34.29
N$305  (via drill 0.7)
  other vias: 133.35,34.29
N$306  (via drill 0.7)
  other vias: 135.89,34.29
N$307  (via drill 0.7)
  other vias: 138.43,34.29
N$308  (via drill 0.7)
  other vias: 140.97,34.29
N$309  (via drill 0.7)
  other vias: 143.51,34.29
N$310  (via drill 0.7)
  other vias: 146.05,36.83
N$311  (via drill 0.7)
  other vias: 148.59,34.29
N$312  (via drill 0.7)
  other vias: 151.13,34.29
N$313  (via drill 0.7)
  other vias: 153.67,34.29
N$314  (via drill 0.7)
  other vias: 128.27,36.83
N$315  (via drill 0.7)
  other vias: 130.81,36.83
N$316  (via drill 0.7)
  other vias: 133.35,36.83
N$317  (via drill 0.7)
  other vias: 135.89,36.83
N$318  (via drill 0.7)
  other vias: 138.43,36.83
N$319  (via drill 0.7)
  other vias: 140.97,36.83
N$320  (via drill 0.7)
  other vias: 143.51,36.83
N$321  (via drill 0.35)
  other vias: 1.52,41.53
N$322  (via drill 0.7)
  other vias: 148.59,36.83
N$323  (via drill 0.7)
  other vias: 151.13,36.83
N$324  (via drill 0.7)
  other vias: 153.67,36.83
N$325  (via drill 0.7)
  other vias: 120.65,24.13
N$326  (via drill 0.7)
  other vias: 123.19,24.13
N$327  (via drill 0.7)
  other vias: 125.73,24.13
N$328  (via drill 0.7)
  other vias: 120.65,26.67
N$329  (via drill 0.7)
  other vias: 123.19,26.67
N$330  (via drill 0.7)
  other vias: 125.73,26.67
N$331  (via drill 0.7)
  other vias: 120.65,29.21
N$332  (via drill 0.7)
  other vias: 123.19,29.21
N$333  (via drill 0.7)
  other vias: 125.73,29.21
N$334  (via drill 0.7)
  other vias: 120.65,31.75
N$335  (via drill 0.7)
  other vias: 123.19,31.75
N$336  (via drill 0.7)
  other vias: 125.73,31.75
N$337  (via drill 0.7)
  other vias: 120.65,34.29
N$338  (via drill 0.7)
  other vias: 123.19,34.29
N$339  (via drill 0.7)
  other vias: 125.73,34.29
N$340  (via drill 0.7)
  other vias: 120.65,36.83
N$341  (via drill 0.7)
  other vias: 123.19,36.83
N$342  (via drill 0.7)
  other vias: 125.73,36.83
N$343  (via drill 0.7)
  other vias: 128.27,6.35
N$344  (via drill 0.7)
  other vias: 130.81,6.35
N$345  (via drill 0.7)
  other vias: 133.35,6.35
N$346  (via drill 0.7)
  other vias: 135.89,6.35
N$347  (via drill 0.7)
  other vias: 138.43,6.35
N$348  (via drill 0.7)
  other vias: 140.97,6.35
N$349  (via drill 0.7)
  other vias: 143.51,6.35
N$350  (via drill 0.7)
  other vias: 146.05,6.35
N$351  (via drill 0.7)
  other vias: 148.59,6.35
N$352  (via drill 0.7)
  other vias: 36.83,38.1
N$353  (via drill 0.7)
  other vias: 39.37,38.1
N$354  (via drill 0.7)
  other vias: 128.27,8.89
N$355  (via drill 0.7)
  other vias: 130.81,8.89
N$356  (via drill 0.7)
  other vias: 133.35,8.89
N$357  (via drill 0.7)
  other vias: 135.89,8.89
N$358  (via drill 0.7)
  other vias: 138.43,8.89
N$359  (via drill 0.7)
  other vias: 140.97,8.89
N$360  (via drill 0.7)
  other vias: 143.51,8.89
N$361  (via drill 0.7)
  other vias: 146.05,8.89
N$362  (via drill 0.7)
  other vias: 148.59,8.89
N$363  (via drill 0.7)
  other vias: 151.13,8.89
N$364  (via drill 0.7)
  other vias: 41.91,38.1
N$365  (via drill 0.7)
  other vias: 128.27,11.43
N$366  (via drill 0.7)
  other vias: 130.81,11.43
N$367  (via drill 0.7)
  other vias: 133.35,11.43
N$368  (via drill 0.7)
  Top 0.2: v80.01,68.58 U$1.P$10
N$369  (via drill 0.7)
  other vias: 135.89,11.43
N$370  (via drill 0.7)
  Top 0.2: v67.31,68.58 U$1.P$15
N$371  (via drill 0.7)
  Top 0.2: v64.77,68.58 U$1.P$16
N$372  (via drill 0.7)
  Top 0.2: v62.23,68.58 U$1.P$17
N$373  (via drill 0.7)
  Top 0.2: v59.69,68.58 U$1.P$18
N$374  (via drill 0.7)
  Top 0.254: U$1.P$19 v57.15,68.58
N$375  (via drill 0.7)
  Top 0.254: U$1.P$20 v54.61,68.58
N$376
  Top 0.152: SPI1.6 SJ5.2
N$377  (via drill 0.7)
  Top 0.2: U$1.P$54 v36.83,40.64
N$378  (via drill 0.7)
  Top 0.2: U$1.P$53 v39.37,40.64
N$379  (via drill 0.7)
  Top 0.2: U$1.P$52 v41.91,40.64
N$380  (via drill 0.7)
  Top 0.2: U$1.P$51 v44.45,40.64
N$381  (via drill 0.7)
  Top 0.2: U$1.P$50 v46.99,40.64
N$382  (via drill 0.7)
  Top 0.2: U$1.P$49 v49.53,40.64
N$383  (via drill 0.7)
  Top 0.2: U$1.P$48 v52.07,40.64
N$384  (via drill 0.7)
  Top 0.2: U$1.P$47 v54.61,40.64
N$385  (via drill 0.7)
  Top 0.2: U$1.P$46 v57.15,40.64
N$386  (via drill 0.7)
  Top 0.2: U$1.P$45 v59.69,40.64
N$387  (via drill 0.7)
  Top 0.2: U$1.P$44 v62.23,40.64
N$388  (via drill 0.7)
  Top 0.2: U$1.P$43 v64.77,40.64
N$389  (via drill 0.7)
  Top 0.2: U$1.P$42 v67.31,40.64
N$397  (via drill 0.7)
  Top 0.254: U$1.P$27 v36.83,68.58
N$398
  Top 0.152: SPI1.5 SJ6.2
N$399
  Top 0.152: SPI1.4 SJ7.2
N$400
  Top 0.152: SJ8.2 SPI1.3
N$401  (via drill 0.7)
  other vias: 138.43,11.43
N$402  (via drill 0.7)
  other vias: 140.97,11.43
N$403  (via drill 0.7)
  other vias: 143.51,11.43
N$404  (via drill 0.7)
  other vias: 146.05,11.43
N$405  (via drill 0.7)
  other vias: 148.59,11.43
N$406  (via drill 0.7)
  other vias: 151.13,11.43
N$407  (via drill 0.7)
  other vias: 153.67,11.43
N$408  (via drill 0.7)
  other vias: 128.27,13.97
N$409  (via drill 0.7)
  other vias: 130.81,13.97
N$410  (via drill 0.7)
  other vias: 133.35,13.97
N$411  (via drill 0.7)
  other vias: 135.89,13.97
N$412  (via drill 0.7)
  other vias: 138.43,13.97
N$413  (via drill 0.7)
  other vias: 140.97,13.97
N$414  (via drill 0.7)
  other vias: 143.51,13.97
N$415  (via drill 0.7)
  other vias: 146.05,13.97
N$416  (via drill 0.7)
  other vias: 148.59,13.97
N$417  (via drill 0.7)
  other vias: 151.13,13.97
N$418  (via drill 0.7)
  other vias: 153.67,13.97
N$419  (via drill 0.7)
  other vias: 128.27,16.51
N$420  (via drill 0.7)
  other vias: 130.81,16.51
N$421  (via drill 0.7)
  other vias: 133.35,16.51
N$422  (via drill 0.7)
  other vias: 135.89,16.51
N$423  (via drill 0.7)
  other vias: 138.43,16.51
N$424  (via drill 0.7)
  other vias: 140.97,16.51
N$425  (via drill 0.7)
  other vias: 143.51,16.51
N$426  (via drill 0.7)
  other vias: 146.05,16.51
N$427  (via drill 0.7)
  other vias: 148.59,16.51
N$428  (via drill 0.7)
  other vias: 151.13,16.51
N$429  (via drill 0.7)
  other vias: 153.67,16.51
N$430  (via drill 0.7)
  other vias: 128.27,19.05
N$431  (via drill 0.7)
  other vias: 130.81,19.05
N$432  (via drill 0.7)
  other vias: 133.35,19.05
N$433  (via drill 0.7)
  other vias: 135.89,19.05
N$434  (via drill 0.7)
  other vias: 138.43,19.05
N$435  (via drill 0.7)
  other vias: 140.97,19.05
N$436  (via drill 0.7)
  other vias: 143.51,19.05
N$437  (via drill 0.7)
  other vias: 146.05,19.05
N$438  (via drill 0.7)
  other vias: 148.59,19.05
N$439  (via drill 0.7)
  other vias: 151.13,19.05
N$440  (via drill 0.7)
  other vias: 153.67,19.05
N$441  (via drill 0.7)
  other vias: 120.65,6.35
N$442  (via drill 0.7)
  other vias: 123.19,6.35
N$443  (via drill 0.7)
  other vias: 125.73,6.35
N$444  (via drill 0.7)
  other vias: 120.65,8.89
N$445  (via drill 0.7)
  other vias: 123.19,8.89
N$446  (via drill 0.7)
  other vias: 125.73,8.89
N$447  (via drill 0.7)
  other vias: 120.65,11.43
N$448  (via drill 0.7)
  other vias: 123.19,11.43
N$449  (via drill 0.7)
  other vias: 125.73,11.43
N$450  (via drill 0.7)
  other vias: 120.65,13.97
N$451  (via drill 0.7)
  other vias: 123.19,13.97
N$452  (via drill 0.7)
  other vias: 125.73,13.97
N$453  (via drill 0.7)
  other vias: 120.65,16.51
N$454  (via drill 0.7)
  other vias: 123.19,16.51
N$455  (via drill 0.7)
  other vias: 125.73,16.51
N$456  (via drill 0.7)
  other vias: 120.65,19.05
N$457  (via drill 0.7)
  other vias: 123.19,19.05
N$458  (via drill 0.7)
  other vias: 125.73,19.05
N$459  (via drill 0.7)
  other vias: 44.45,38.1
N$460  (via drill 0.7)
  other vias: 46.99,38.1
N$461  (via drill 0.7)
  other vias: 49.53,38.1
N$462  (via drill 0.7)
  other vias: 52.07,38.1
N$463  (via drill 0.7)
  other vias: 54.61,38.1
N$464  (via drill 0.7)
  other vias: 57.15,38.1
N$465  (via drill 0.7)
  other vias: 59.69,38.1
N$466  (via drill 0.7)
  other vias: 62.23,38.1
N$467  (via drill 0.7)
  other vias: 64.77,38.1
N$468  (via drill 0.7)
  other vias: 67.31,38.1
N$469  (via drill 0.7)
  other vias: 69.85,38.1
N$470  (via drill 0.7)
  other vias: 72.39,38.1
N$471  (via drill 0.7)
  other vias: 74.93,38.1
N$472  (via drill 0.7)
  other vias: 77.47,38.1
N$473  (via drill 0.7)
  other vias: 80.01,38.1
N$474  (via drill 0.7)
  other vias: 82.55,38.1
N$475  (via drill 0.7)
  other vias: 85.09,38.1
N$476  (via drill 0.7)
  other vias: 87.63,38.1
N$477  (via drill 0.7)
  other vias: 90.17,38.1
N$478  (via drill 0.7)
  other vias: 92.71,38.1
N$479  (via drill 0.7)
  other vias: 95.25,38.1
N$480  (via drill 0.7)
  other vias: 97.79,38.1
N$481  (via drill 0.7)
  other vias: 100.33,38.1
N$482  (via drill 0.7)
  other vias: 102.87,38.1
N$483  (via drill 0.7)
  other vias: 36.83,35.56
N$484  (via drill 0.7)
  other vias: 39.37,35.56
N$485  (via drill 0.7)
  other vias: 41.91,35.56
N$486  (via drill 0.7)
  other vias: 44.45,35.56
N$487  (via drill 0.7)
  other vias: 46.99,35.56
N$488  (via drill 0.7)
  other vias: 49.53,35.56
N$489  (via drill 0.7)
  other vias: 52.07,35.56
N$490  (via drill 0.7)
  other vias: 54.61,35.56
N$491  (via drill 0.7)
  other vias: 57.15,35.56
N$492  (via drill 0.7)
  other vias: 59.69,35.56
N$493  (via drill 0.7)
  other vias: 62.23,35.56
N$494  (via drill 0.7)
  other vias: 64.77,35.56
N$495  (via drill 0.7)
  other vias: 67.31,35.56
N$496  (via drill 0.7)
  other vias: 69.85,35.56
N$497  (via drill 0.7)
  other vias: 72.39,35.56
N$498  (via drill 0.7)
  other vias: 74.93,35.56
N$499  (via drill 0.7)
  other vias: 77.47,35.56
N$500  (via drill 0.7)
  other vias: 80.01,35.56
N$501  (via drill 0.7)
  other vias: 82.55,35.56
N$502  (via drill 0.7)
  other vias: 85.09,35.56
N$503  (via drill 0.7)
  other vias: 87.63,35.56
N$504  (via drill 0.7)
  other vias: 90.17,35.56
N$505  (via drill 0.7)
  other vias: 92.71,35.56
N$506  (via drill 0.7)
  other vias: 95.25,35.56
N$507  (via drill 0.7)
  other vias: 97.79,35.56
N$508  (via drill 0.7)
  other vias: 100.33,35.56
N$509  (via drill 0.7)
  other vias: 102.87,35.56
N$510  (via drill 0.7)
  other vias: 41.91,33.02
N$511  (via drill 0.7)
  other vias: 44.45,33.02
N$512  (via drill 0.7)
  other vias: 46.99,33.02
N$513  (via drill 0.7)
  other vias: 49.53,33.02
N$514  (via drill 0.7)
  other vias: 52.07,33.02
N$515  (via drill 0.7)
  other vias: 54.61,33.02
N$516  (via drill 0.7)
  other vias: 57.15,33.02
N$517  (via drill 0.7)
  other vias: 59.69,33.02
N$518  (via drill 0.7)
  other vias: 62.23,33.02
N$519  (via drill 0.7)
  other vias: 64.77,33.02
N$520  (via drill 0.7)
  other vias: 67.31,33.02
N$521  (via drill 0.7)
  other vias: 69.85,33.02
N$522  (via drill 0.7)
  other vias: 72.39,33.02
N$523  (via drill 0.7)
  other vias: 74.93,33.02
N$524  (via drill 0.7)
  other vias: 77.47,33.02
N$525  (via drill 0.7)
  other vias: 80.01,33.02
N$526  (via drill 0.7)
  other vias: 82.55,33.02
N$527  (via drill 0.7)
  other vias: 85.09,33.02
N$528  (via drill 0.7)
  other vias: 87.63,33.02
N$529  (via drill 0.7)
  other vias: 90.17,33.02
N$530  (via drill 0.7)
  other vias: 92.71,33.02
N$531  (via drill 0.7)
  other vias: 95.25,33.02
N$532  (via drill 0.7)
  other vias: 97.79,33.02
N$533  (via drill 0.7)
  other vias: 100.33,33.02
N$534  (via drill 0.7)
  other vias: 102.87,33.02
N$535  (via drill 0.7)
  other vias: 41.91,30.48
N$536  (via drill 0.7)
  other vias: 44.45,30.48
N$537  (via drill 0.7)
  other vias: 46.99,30.48
N$538  (via drill 0.7)
  other vias: 49.53,30.48
N$539  (via drill 0.7)
  other vias: 52.07,30.48
N$540  (via drill 0.7)
  other vias: 54.61,30.48
N$541  (via drill 0.7)
  other vias: 57.15,30.48
N$542  (via drill 0.7)
  other vias: 59.69,30.48
N$543  (via drill 0.7)
  other vias: 62.23,30.48
N$544  (via drill 0.7)
  other vias: 64.77,30.48
N$545  (via drill 0.7)
  other vias: 67.31,30.48
N$546  (via drill 0.7)
  other vias: 69.85,30.48
N$547  (via drill 0.7)
  other vias: 72.39,30.48
N$548  (via drill 0.7)
  other vias: 74.93,30.48
N$549  (via drill 0.7)
  other vias: 77.47,30.48
N$550  (via drill 0.7)
  other vias: 80.01,30.48
N$551  (via drill 0.7)
  other vias: 82.55,30.48
N$552  (via drill 0.7)
  other vias: 85.09,30.48
N$553  (via drill 0.7)
  other vias: 87.63,30.48
N$554  (via drill 0.7)
  other vias: 90.17,30.48
N$555  (via drill 0.7)
  other vias: 92.71,30.48
N$556  (via drill 0.7)
  other vias: 95.25,30.48
N$557  (via drill 0.7)
  other vias: 97.79,30.48
N$558  (via drill 0.7)
  other vias: 100.33,30.48
N$559  (via drill 0.7)
  other vias: 102.87,30.48
N$560  (via drill 0.7)
  other vias: 41.91,27.94
N$561  (via drill 0.7)
  other vias: 44.45,27.94
N$562  (via drill 0.7)
  other vias: 46.99,27.94
N$563  (via drill 0.7)
  other vias: 49.53,27.94
N$564  (via drill 0.7)
  other vias: 52.07,27.94
N$565  (via drill 0.7)
  other vias: 54.61,27.94
N$566  (via drill 0.7)
  other vias: 57.15,27.94
N$567  (via drill 0.7)
  other vias: 59.69,27.94
N$568  (via drill 0.7)
  other vias: 62.23,27.94
N$569  (via drill 0.7)
  other vias: 64.77,27.94
N$570  (via drill 0.7)
  other vias: 67.31,27.94
N$571  (via drill 0.7)
  other vias: 69.85,27.94
N$572  (via drill 0.7)
  other vias: 72.39,27.94
N$573  (via drill 0.7)
  other vias: 74.93,27.94
N$574  (via drill 0.7)
  other vias: 77.47,27.94
N$575  (via drill 0.7)
  other vias: 80.01,27.94
N$576  (via drill 0.7)
  other vias: 82.55,27.94
N$577  (via drill 0.7)
  other vias: 85.09,27.94
N$578  (via drill 0.7)
  other vias: 87.63,27.94
N$579  (via drill 0.7)
  other vias: 90.17,27.94
N$580  (via drill 0.7)
  other vias: 92.71,27.94
N$581  (via drill 0.7)
  other vias: 95.25,27.94
N$582  (via drill 0.7)
  other vias: 97.79,27.94
N$583  (via drill 0.7)
  other vias: 100.33,27.94
N$584  (via drill 0.7)
  other vias: 102.87,27.94
N$585  (via drill 0.7)
  other vias: 41.91,20.32
N$586  (via drill 0.7)
  other vias: 44.45,20.32
N$587  (via drill 0.7)
  other vias: 46.99,20.32
N$588  (via drill 0.7)
  other vias: 49.53,20.32
N$589  (via drill 0.7)
  other vias: 52.07,20.32
N$590  (via drill 0.7)
  other vias: 54.61,20.32
N$591  (via drill 0.7)
  other vias: 57.15,20.32
N$592  (via drill 0.7)
  other vias: 59.69,20.32
N$593  (via drill 0.7)
  other vias: 62.23,20.32
N$594  (via drill 0.7)
  other vias: 64.77,20.32
N$595  (via drill 0.7)
  other vias: 67.31,20.32
N$596  (via drill 0.7)
  other vias: 69.85,20.32
N$597  (via drill 0.7)
  other vias: 72.39,20.32
N$598  (via drill 0.7)
  other vias: 74.93,20.32
N$599  (via drill 0.7)
  other vias: 77.47,20.32
N$600  (via drill 0.7)
  other vias: 80.01,20.32
N$601  (via drill 0.7)
  other vias: 82.55,20.32
N$602  (via drill 0.7)
  other vias: 85.09,20.32
N$603  (via drill 0.7)
  other vias: 87.63,20.32
N$604  (via drill 0.7)
  other vias: 90.17,20.32
N$605  (via drill 0.7)
  other vias: 92.71,20.32
N$606  (via drill 0.7)
  other vias: 95.25,20.32
N$607  (via drill 0.7)
  other vias: 97.79,20.32
N$608  (via drill 0.7)
  other vias: 100.33,20.32
N$609  (via drill 0.7)
  other vias: 102.87,20.32
N$610  (via drill 0.7)
  other vias: 41.91,17.78
N$611  (via drill 0.7)
  other vias: 44.45,17.78
N$612  (via drill 0.7)
  other vias: 46.99,17.78
N$613  (via drill 0.7)
  other vias: 49.53,17.78
N$614  (via drill 0.7)
  other vias: 52.07,17.78
N$615  (via drill 0.7)
  other vias: 54.61,17.78
N$616  (via drill 0.7)
  other vias: 57.15,17.78
N$617  (via drill 0.7)
  other vias: 59.69,17.78
N$618  (via drill 0.7)
  other vias: 62.23,17.78
N$619  (via drill 0.7)
  other vias: 64.77,17.78
N$620  (via drill 0.7)
  other vias: 67.31,17.78
N$621  (via drill 0.7)
  other vias: 69.85,17.78
N$622  (via drill 0.7)
  other vias: 72.39,17.78
N$623  (via drill 0.7)
  other vias: 74.93,17.78
N$624  (via drill 0.7)
  other vias: 77.47,17.78
N$625  (via drill 0.7)
  other vias: 80.01,17.78
N$626  (via drill 0.7)
  other vias: 82.55,17.78
N$627  (via drill 0.7)
  other vias: 85.09,17.78
N$628  (via drill 0.7)
  other vias: 87.63,17.78
N$629  (via drill 0.7)
  other vias: 90.17,17.78
N$630  (via drill 0.7)
  other vias: 92.71,17.78
N$631  (via drill 0.7)
  other vias: 95.25,17.78
N$632  (via drill 0.7)
  other vias: 97.79,17.78
N$633  (via drill 0.7)
  other vias: 100.33,17.78
N$634  (via drill 0.7)
  other vias: 102.87,17.78
N$635  (via drill 0.7)
  other vias: 41.91,15.24
N$636  (via drill 0.7)
  other vias: 44.45,15.24
N$637  (via drill 0.7)
  other vias: 46.99,15.24
N$638  (via drill 0.7)
  other vias: 49.53,15.24
N$639  (via drill 0.7)